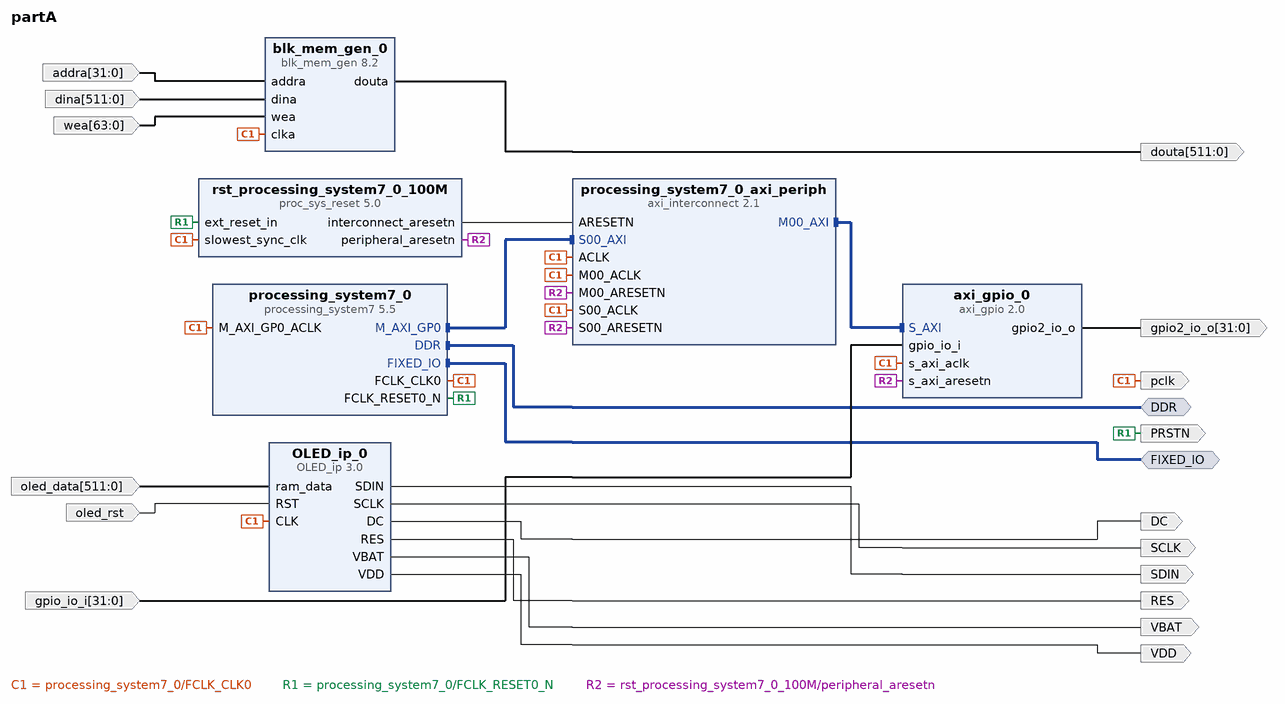
[diagram p0: block diagram of the top level]
# Vivado block design partA, Vivado 2015.1
create_bd_design partA

create_bd_intf_port -mode Master -vlnv xilinx.com:interface:ddrx_rtl:1.0 DDR
create_bd_intf_port -mode Master -vlnv xilinx.com:display_processing_system7:fixedio_rtl:1.0 FIXED_IO
create_bd_port -dir O -type clk pclk
create_bd_port -dir O PRSTN
create_bd_port -dir I -from 31 -to 0 gpio_io_i
create_bd_port -dir O -from 31 -to 0 gpio2_io_o
create_bd_port -dir I -from 31 -to 0 addra
create_bd_port -dir I -from 511 -to 0 dina
create_bd_port -dir O -from 511 -to 0 douta
create_bd_port -dir I -from 63 -to 0 wea
create_bd_port -dir O SDIN
create_bd_port -dir O SCLK
create_bd_port -dir O DC
create_bd_port -dir O RES
create_bd_port -dir O VBAT
create_bd_port -dir O VDD
create_bd_port -dir I -from 511 -to 0 oled_data
create_bd_port -dir I -type rst oled_rst

create_bd_cell -type ip -vlnv xilinx.com:ip:processing_system7:5.5 processing_system7_0
set_property -dict {CONFIG.PCW_QSPI_GRP_SINGLE_SS_ENABLE 1 CONFIG.preset ZedBoard} [get_bd_cells processing_system7_0]
create_bd_cell -type ip -vlnv xilinx.com:ip:axi_gpio:2.0 axi_gpio_0
set_property -dict [list \
  CONFIG.C_IS_DUAL 1 \
  CONFIG.C_ALL_INPUTS 1 \
  CONFIG.C_ALL_INPUTS_2 0 \
  CONFIG.USE_BOARD_FLOW true \
  CONFIG.GPIO2_BOARD_INTERFACE Custom \
  CONFIG.C_ALL_OUTPUTS_2 1 \
] [get_bd_cells axi_gpio_0]
create_bd_cell -type ip -vlnv xilinx.com:ip:axi_interconnect:2.1 processing_system7_0_axi_periph
set_property -dict {CONFIG.NUM_MI 1} [get_bd_cells processing_system7_0_axi_periph]
create_bd_cell -type ip -vlnv xilinx.com:ip:proc_sys_reset:5.0 rst_processing_system7_0_100M
create_bd_cell -type ip -vlnv xilinx.com:ip:blk_mem_gen:8.2 blk_mem_gen_0
set_property -dict [list \
  CONFIG.Enable_32bit_Address true \
  CONFIG.Write_Width_A 512 \
  CONFIG.Write_Depth_A 32 \
  CONFIG.Read_Width_A 512 \
  CONFIG.Enable_A Always_Enabled \
  CONFIG.Register_PortA_Output_of_Memory_Primitives true \
  CONFIG.Use_RSTA_Pin false \
  CONFIG.use_bram_block Stand_Alone \
] [get_bd_cells blk_mem_gen_0]
create_bd_cell -type ip -vlnv Tan_Enyu:central_controller_ip:OLED_ip:3.0 OLED_ip_0

# ---- connections ----

connect_bd_intf_net [get_bd_intf_pins processing_system7_0/M_AXI_GP0] [get_bd_intf_pins processing_system7_0_axi_periph/S00_AXI]
connect_bd_intf_net [get_bd_intf_pins processing_system7_0_axi_periph/M00_AXI] [get_bd_intf_pins axi_gpio_0/S_AXI]
connect_bd_intf_net [get_bd_intf_ports DDR] [get_bd_intf_pins processing_system7_0/DDR]
connect_bd_intf_net [get_bd_intf_ports FIXED_IO] [get_bd_intf_pins processing_system7_0/FIXED_IO]
connect_bd_net [get_bd_pins processing_system7_0/FCLK_CLK0] \
  [get_bd_ports pclk] [get_bd_pins processing_system7_0/M_AXI_GP0_ACLK] \
  [get_bd_pins rst_processing_system7_0_100M/slowest_sync_clk] [get_bd_pins axi_gpio_0/s_axi_aclk] \
  [get_bd_pins blk_mem_gen_0/clka] [get_bd_pins OLED_ip_0/CLK] [get_bd_pins processing_system7_0_axi_periph/S00_ACLK] \
  [get_bd_pins processing_system7_0_axi_periph/ACLK] [get_bd_pins processing_system7_0_axi_periph/M00_ACLK]
connect_bd_net [get_bd_pins processing_system7_0/FCLK_RESET0_N] [get_bd_ports PRSTN] [get_bd_pins rst_processing_system7_0_100M/ext_reset_in]
connect_bd_net [get_bd_pins rst_processing_system7_0_100M/interconnect_aresetn] [get_bd_pins processing_system7_0_axi_periph/ARESETN]
connect_bd_net [get_bd_ports gpio_io_i] [get_bd_pins axi_gpio_0/gpio_io_i]
connect_bd_net [get_bd_pins axi_gpio_0/gpio2_io_o] [get_bd_ports gpio2_io_o]
connect_bd_net [get_bd_ports addra] [get_bd_pins blk_mem_gen_0/addra]
connect_bd_net [get_bd_ports dina] [get_bd_pins blk_mem_gen_0/dina]
connect_bd_net [get_bd_pins blk_mem_gen_0/douta] [get_bd_ports douta]
connect_bd_net [get_bd_ports wea] [get_bd_pins blk_mem_gen_0/wea]
connect_bd_net [get_bd_pins OLED_ip_0/SDIN] [get_bd_ports SDIN]
connect_bd_net [get_bd_pins OLED_ip_0/SCLK] [get_bd_ports SCLK]
connect_bd_net [get_bd_pins OLED_ip_0/DC] [get_bd_ports DC]
connect_bd_net [get_bd_pins OLED_ip_0/RES] [get_bd_ports RES]
connect_bd_net [get_bd_pins OLED_ip_0/VBAT] [get_bd_ports VBAT]
connect_bd_net [get_bd_pins OLED_ip_0/VDD] [get_bd_ports VDD]
connect_bd_net [get_bd_ports oled_data] [get_bd_pins OLED_ip_0/ram_data]
connect_bd_net [get_bd_pins rst_processing_system7_0_100M/peripheral_aresetn] \
  [get_bd_pins axi_gpio_0/s_axi_aresetn] [get_bd_pins processing_system7_0_axi_periph/M00_ARESETN] \
  [get_bd_pins processing_system7_0_axi_periph/S00_ARESETN]
connect_bd_net [get_bd_ports oled_rst] [get_bd_pins OLED_ip_0/RST]

# ---- address map ----
assign_bd_address -offset 0x41200000 -range 64K -target_address_space [get_bd_addr_spaces processing_system7_0/Data] [get_bd_addr_segs axi_gpio_0/S_AXI/Reg]

validate_bd_design
save_bd_design
